# EAGLE schematic tarjeta-v8 (EAGLE 6.4)
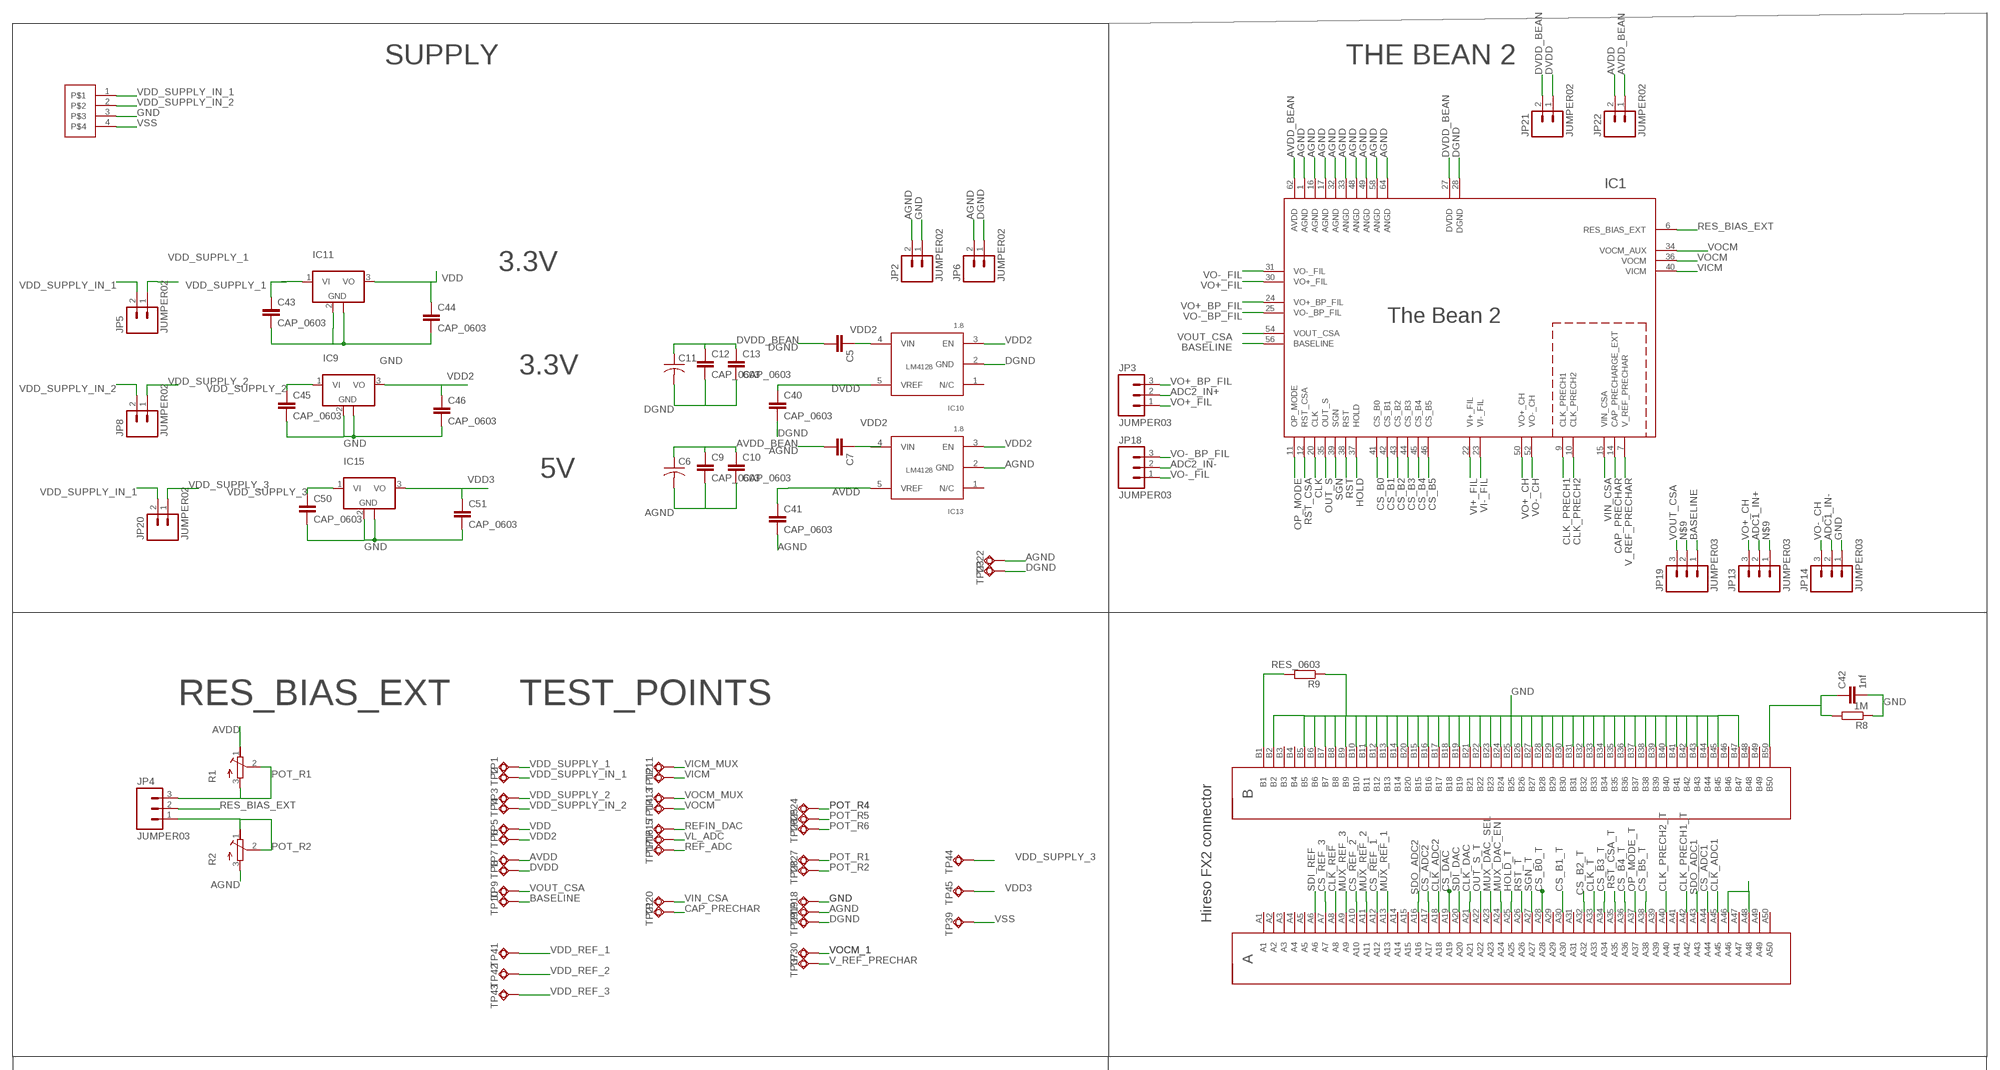
[diagram p0: schematic, sheet 1, part 1 of 3]
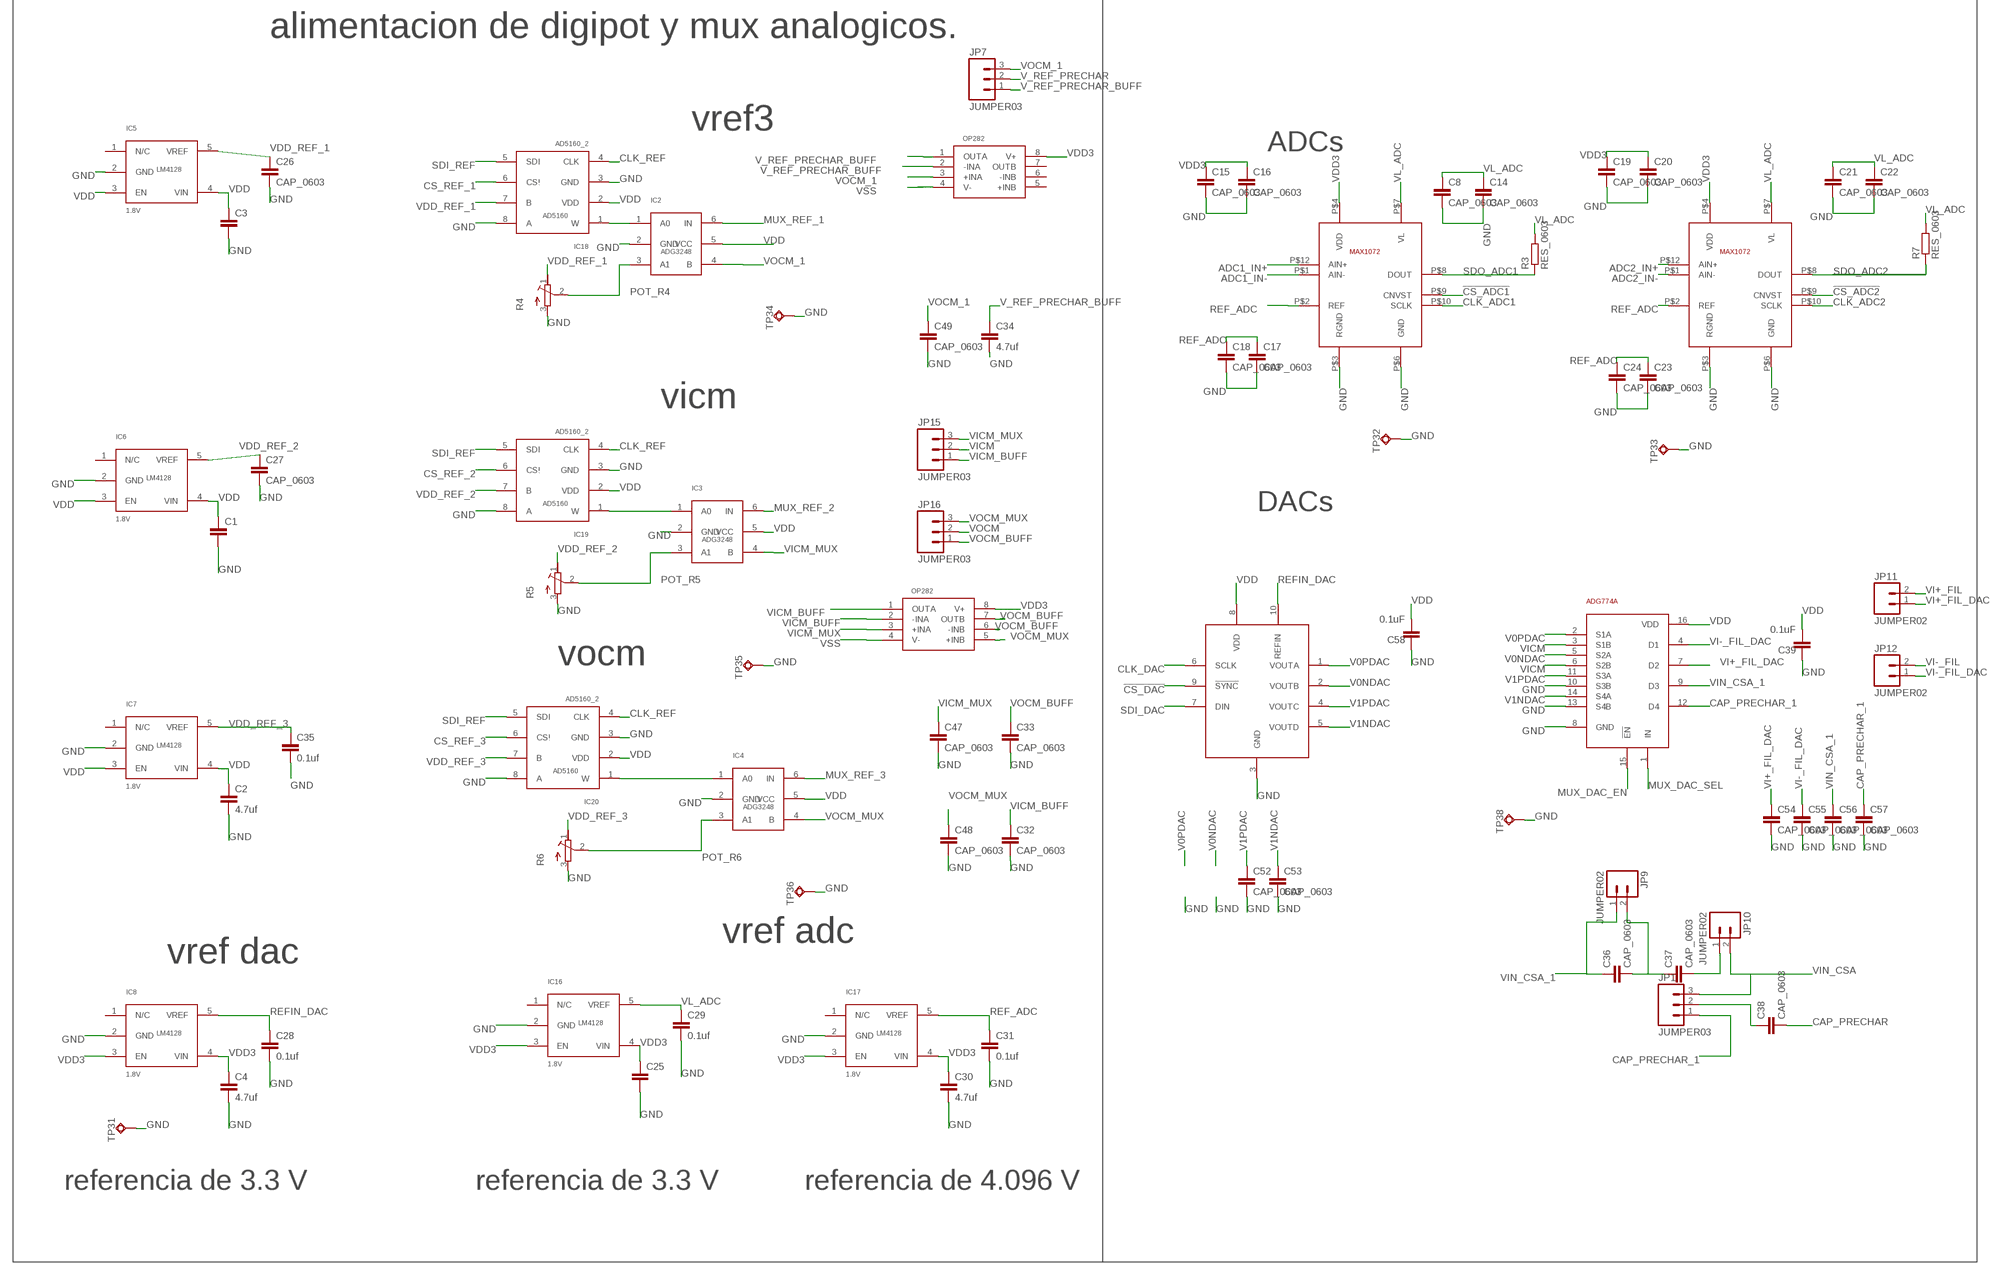
[diagram p1: schematic, sheet 1, part 2 of 3]
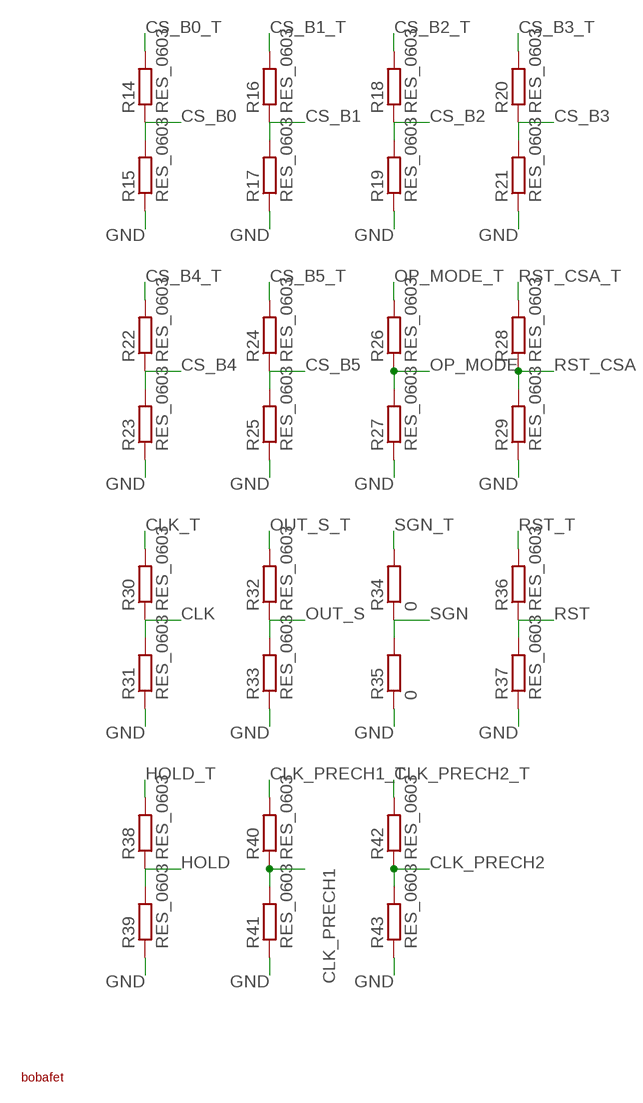
[diagram p2: schematic, sheet 1, part 3 of 3]

## Parts
C1  CAP_0402  [C0402]
C2  4.7uf  CAP_0402  [C0402]
C3  CAP_0402  [C0402]
C4  4.7uf  CAP_0402  [C0402]
C5  CAP_0402  [C0402]
C6  CAP_0805  [C0805]
C7  CAP_0402  [C0402]
C8  CAP_0603  [C0603]
C9  CAP_0603  [C0603]
C10  CAP_0603  [C0603]
C11  CAP_0805  [C0805]
C12  CAP_0603  [C0603]
C13  CAP_0603  [C0603]
C14  CAP_0603  [C0603]
C15  CAP_0603  [C0603]
C16  CAP_0603  [C0603]
C17  CAP_0603  [C0603]
C18  CAP_0603  [C0603]
C19  CAP_0603  [C0603]
C20  CAP_0603  [C0603]
C21  CAP_0603  [C0603]
C22  CAP_0603  [C0603]
C23  CAP_0603  [C0603]
C24  CAP_0603  [C0603]
C25  CAP_0402  [C0402]
C26  CAP_0603  [C0603]
C27  CAP_0603  [C0603]
C28  0.1uf  CAP_0603  [C0603]
C29  0.1uf  CAP_0603  [C0603]
C30  4.7uf  CAP_0402  [C0402]
C31  0.1uf  CAP_0603  [C0603]
C32  CAP_0603  [C0603]
C33  CAP_0603  [C0603]
C34  4.7uf  CAP_0603  [C0603]
C35  0.1uf  CAP_0603  [C0603]
C36  CAP_0603  [C0603]
C37  CAP_0603  [C0603]
C38  CAP_0603  [C0603]
C39  0.1uF  CAP_0603  [C0603]
C40  CAP_0603  [C0603]
C41  CAP_0603  [C0603]
C42  1nf  CAP_0603  [C0603]
C43  CAP_0603  [C0603]
C44  CAP_0603  [C0603]
C45  CAP_0603  [C0603]
C46  CAP_0603  [C0603]
C47  CAP_0603  [C0603]
C48  CAP_0603  [C0603]
C49  CAP_0603  [C0603]
C50  CAP_0603  [C0603]
C51  CAP_0603  [C0603]
C52  CAP_0603  [C0603]
C53  CAP_0603  [C0603]
C54  CAP_0603  [C0603]
C55  CAP_0603  [C0603]
C56  CAP_0603  [C0603]
C57  CAP_0603  [C0603]
C58  0.1uF  CAP_0603  [C0603]
IC1  THE_BEAN_2  [QFN64]
IC2  ADG3248  [SC70]
IC3  ADG3248  [SC70]
IC4  ADG3248  [SC70]
IC5  1.8V  LM4128_2  [SOT23-5L_2]
IC6  1.8V  LM4128_2  [SOT23-5L_2]
IC7  1.8V  LM4128_2  [SOT23-5L_2]
IC8  1.8V  LM4128_2  [SOT23-5L_2]
IC9  UA78M  [SOT223]
IC10  1.8  LM4128_2  [SOT23-5L_2]
IC11  UA78M  [SOT223]
IC12  OP282  [SOIC8]
IC13  1.8  LM4128_2  [SOT23-5L_2]
IC14  OP282  [SOIC8]
IC15  UA78M  [SOT223]
IC16  1.8V  LM4128_2  [SOT23-5L_2]
IC17  1.8V  LM4128_2  [SOT23-5L_2]
IC18  AD5160_2  [SOT23-8_2]
IC19  AD5160_2  [SOT23-8_2]
IC20  AD5160_2  [SOT23-8_2]
IC21  ADG774A  [QSOP16]
IC22  MAX1072  [TQFN12]
IC23  DAC7554  [MSOP10]
IC24  MAX1072  [TQFN12]
J1  HIRESO_FX_CONNECTOR  [FX2-100S-1.27]
JP1  JUMPER03  [1X03]
JP2  JUMPER02  [1X02]
JP3  JUMPER03  [1X03]
JP4  JUMPER03  [1X03]
JP5  JUMPER02  [1X02]
JP6  JUMPER02  [1X02]
JP7  JUMPER03  [1X03]
JP8  JUMPER02  [1X02]
JP9  JUMPER02  [1X02]
JP10  JUMPER02  [1X02]
JP11  JUMPER02  [1X02]
JP12  JUMPER02  [1X02]
JP13  JUMPER03  [1X03]
JP14  JUMPER03  [1X03]
JP15  JUMPER03  [1X03]
JP16  JUMPER03  [1X03]
JP17  JUMPER04  [1X04]
JP18  JUMPER03  [1X03]
JP19  JUMPER03  [1X03]
JP20  JUMPER02  [1X02]
JP21  JUMPER02  [1X02]
JP22  JUMPER02  [1X02]
R1  TRIMMER_ST5  [ST-5EW]
R2  TRIMMER_ST5  [ST-5EW]
R3  RES_0603  [R0603]
R4  TRIMMER_ST5  [ST-5EW]
R5  TRIMMER_ST5  [ST-5EW]
R6  TRIMMER_ST5  [ST-5EW]
R7  RES_0603  [R0603]
R8  1M  RES_0603  [R0603]
R9  RES_0603  [R0603]
R14  RES_0603  [R0603]
R15  RES_0603  [R0603]
R16  RES_0603  [R0603]
R17  RES_0603  [R0603]
R18  RES_0603  [R0603]
R19  RES_0603  [R0603]
R20  RES_0603  [R0603]
R21  RES_0603  [R0603]
R22  RES_0603  [R0603]
R23  RES_0603  [R0603]
R24  RES_0603  [R0603]
R25  RES_0603  [R0603]
R26  RES_0603  [R0603]
R27  RES_0603  [R0603]
R28  RES_0603  [R0603]
R29  RES_0603  [R0603]
R30  RES_0603  [R0603]
R31  RES_0603  [R0603]
R32  RES_0603  [R0603]
R33  RES_0603  [R0603]
R34  0  RES_0603  [R0603]
R35  0  RES_0603  [R0603]
R36  RES_0603  [R0603]
R37  RES_0603  [R0603]
R38  RES_0603  [R0603]
R39  RES_0603  [R0603]
R40  RES_0603  [R0603]
R41  RES_0603  [R0603]
R42  RES_0603  [R0603]
R43  RES_0603  [R0603]
TP1  TEST_POINT  [TP]
TP2  TEST_POINT  [TP]
TP3  TEST_POINT  [TP]
TP4  TEST_POINT  [TP]
TP5  TEST_POINT  [TP]
TP6  TEST_POINT  [TP]
TP7  TEST_POINT  [TP]
TP8  TEST_POINT  [TP]
TP9  TEST_POINT  [TP]
TP10  TEST_POINT  [TP]
TP11  TEST_POINT  [TP]
TP12  TEST_POINT  [TP]
TP13  TEST_POINT  [TP]
TP14  TEST_POINT  [TP]
TP15  TEST_POINT  [TP]
TP16  TEST_POINT  [TP]
TP17  TEST_POINT  [TP]
TP18  TEST_POINT  [TP]
TP19  TEST_POINT  [TP]
TP20  TEST_POINT  [TP]
TP21  TEST_POINT  [TP]
TP22  TEST_POINT  [TP]
TP23  TEST_POINT  [TP]
TP24  TEST_POINT  [TP]
TP25  TEST_POINT  [TP]
TP26  TEST_POINT  [TP]
TP27  TEST_POINT  [TP]
TP28  TEST_POINT  [TP]
TP29  TEST_POINT  [TP]
TP30  TEST_POINT  [TP]
TP31  TEST_POINT  [TP]
TP32  TEST_POINT  [TP]
TP33  TEST_POINT  [TP]
TP34  TEST_POINT  [TP]
TP35  TEST_POINT  [TP]
TP36  TEST_POINT  [TP]
TP37  TEST_POINT  [TP]
TP38  TEST_POINT  [TP]
TP39  TEST_POINT  [TP]
TP41  TEST_POINT  [TP]
TP42  TEST_POINT  [TP]
TP43  TEST_POINT  [TP]
TP44  TEST_POINT  [TP]
TP45  TEST_POINT  [TP]
U$1  LOGO  [LOGO]

## Nets
!CS_ADC1: IC22.P$9(CNVST) J1.A44
!CS_ADC2: IC24.P$9(CNVST) J1.A17
!CS_DAC: IC23.9(!SYNC) J1.A19
ADC1_IN+: IC22.P$12(AIN+) JP13.2
ADC1_IN-: IC22.P$1(AIN-) JP14.2
ADC2_IN+: IC24.P$12(AIN+) JP3.2
ADC2_IN-: IC24.P$1(AIN-) JP18.2
AGND: C6.2 C7.2 C9.2 C10.2 C41.2 IC1.1(AGND) IC1.16(AGND) IC1.17(AGND) IC1.32(AGND) IC1.33(ANGD) IC1.48(ANGD) IC1.49(ANGD) IC1.58(ANGD) IC1.64(ANGD) IC13.2(GND) JP2.2 JP6.2 R2.3 TP19.TP TP22.TP
AVDD: C41.1 IC13.5(VREF) JP22.2 R1.1 TP7.TP
AVDD_BEAN: C6.1 C9.1 C10.1 IC1.62(AVDD) JP22.1
BASELINE: IC1.56(BASELINE) JP19.1 TP10.TP
CAP_PRECHAR: C38.2 IC1.14(CAP_PRECHARGE_EXT) TP21.TP
CAP_PRECHAR_1: C57.1 IC21.12(D4) JP1.1
CLK: IC1.20(CLK) R30.1 R31.2
CLK_ADC1: IC22.P$10(SCLK) J1.A45
CLK_ADC2: IC24.P$10(SCLK) J1.A18
CLK_DAC: IC23.6(SCLK) J1.A21
CLK_PRECH1: IC1.9(CLK_PRECH1) R40.1 R41.2
CLK_PRECH1_T: J1.A42 R40.2
CLK_PRECH2: IC1.10(CLK_PRECH2) R42.1 R43.2
CLK_PRECH2_T: J1.A40 R42.2
CLK_REF: IC18.4(CLK) IC19.4(CLK) IC20.4(CLK) J1.A8
CLK_T: J1.A33 R30.2
CS_B0: IC1.41(CS_B0) R14.1 R15.2
CS_B0_T: J1.A28 R14.2
CS_B1: IC1.42(CS_B1) R16.1 R17.2
CS_B1_T: J1.A30 R16.2
CS_B2: IC1.43(CS_B2) R18.1 R19.2
CS_B2_T: J1.A32 R18.2
CS_B3: IC1.44(CS_B3) R20.1 R21.2
CS_B3_T: J1.A34 R20.2
CS_B4: IC1.45(CS_B4) R22.1 R23.2
CS_B4_T: J1.A36 R22.2
CS_B5: IC1.46(CS_B5) R24.1 R25.2
CS_B5_T: J1.A38 R24.2
CS_REF_1: IC18.6(CS!) J1.A12
CS_REF_2: IC19.6(CS!) J1.A10
CS_REF_3: IC20.6(CS!) J1.A7
DGND: C5.2 C11.2 C12.2 C13.2 C40.2 IC1.28(DGND) IC10.2(GND) JP6.1 TP23.TP TP29.TP
DVDD: C40.1 IC10.5(VREF) JP21.1 TP8.TP
DVDD_BEAN: C11.1 C12.1 C13.1 IC1.27(DVDD) JP21.2
GND: C1.2 C2.2 C3.2 C4.2 C8.2 C14.2 C15.2 C16.2 C17.2 C18.2 C19.2 C20.2 C21.2 C22.2 C23.2 C24.2 C25.2 C26.2 C27.2 C28.2 C29.2 C30.2 C31.2 C32.2 C33.2 C34.2 C35.2 C39.1 C42.2 C43.2 C44.2 C45.2 C46.2 C47.2 C48.2 C49.2 C50.2 C51.2 C52.2 C53.2 C54.2 C55.2 C56.2 C57.2 C58.1 IC2.2(GND) IC3.2(GND) IC4.2(GND) IC5.2(GND) IC6.2(GND) IC7.2(GND) IC8.2(GND) IC9.2(GND) IC9.4(GND) IC11.2(GND) IC11.4(GND) IC15.2(GND) IC15.4(GND) IC16.2(GND) IC17.2(GND) IC18.3(GND) IC18.8(A) IC19.3(GND) IC19.8(A) IC20.3(GND) IC20.8(A) IC21.8(GND) IC21.10(S3B) IC21.13(S4B) IC22.P$3(RGND) IC22.P$6(GND) IC23.3(GND) IC24.P$3(RGND) IC24.P$6(GND) J1.B2 J1.B5 J1.B6 J1.B7 J1.B8 J1.B9 J1.B10 J1.B11 J1.B12 J1.B13 J1.B14 J1.B15 J1.B16 J1.B17 J1.B18 J1.B19 J1.B20 J1.B21 J1.B22 J1.B23 J1.B24 J1.B25 J1.B26 J1.B27 J1.B28 J1.B29 J1.B30 J1.B31 J1.B32 J1.B33 J1.B34 J1.B35 J1.B36 J1.B37 J1.B38 J1.B39 J1.B40 J1.B41 J1.B42 J1.B43 J1.B44 J1.B45 J1.B47 JP2.1 JP14.1 JP17.3 R4.3 R5.3 R6.3 R8.1 R9.1 R15.1 R17.1 R19.1 R21.1 R23.1 R25.1 R27.1 R29.1 R31.1 R33.1 R35.1 R37.1 R39.1 R41.1 R43.1 TP18.TP TP31.TP TP32.TP TP33.TP TP34.TP TP35.TP TP36.TP TP38.TP
HOLD: IC1.37(HOLD) R38.1 R39.2
HOLD_T: J1.A25 R38.2
MUX_DAC_EN: IC21.15(!EN) J1.A24
MUX_DAC_SEL: IC21.1(IN) J1.A23
MUX_REF_1: IC2.6(IN) J1.A13
MUX_REF_2: IC3.6(IN) J1.A11
MUX_REF_3: IC4.6(IN) J1.A9
N$1: C36.2 C37.1 JP9.2
N$2: J1.B1 R9.2
N$3: C37.2 JP10.1
N$4: J1.A46 J1.A48
N$5: IC4.1(A0) IC20.1(W)
N$6: C38.1 JP1.2
N$9: JP13.1 JP19.2
N$10: C42.1 J1.B50 R8.2
N$17: IC2.1(A0) IC18.1(W)
N$19: IC3.1(A0) IC19.1(W)
OP_MODE: IC1.11(OP_MODE) R26.1 R27.2
OP_MODE_T: J1.A37 R26.2
OUT_S: IC1.35(OUT_S) R32.1 R33.2
OUT_S_T: J1.A22 R32.2
POT_R1: JP4.3 R1.2 R1.3 TP27.TP
POT_R2: JP4.1 R2.1 R2.2 TP28.TP
POT_R4: IC2.3(A1) R4.2 TP24.TP
POT_R5: IC3.3(A1) R5.2 TP25.TP
POT_R6: IC4.3(A1) R6.2 TP26.TP
REF_ADC: C17.1 C18.1 C23.1 C24.1 C31.1 IC17.5(VREF) IC22.P$2(REF) IC24.P$2(REF) TP17.TP
REFIN_DAC: C28.1 IC8.5(VREF) IC23.10(REFIN) TP15.TP
RES_BIAS_EXT: IC1.6(RES_BIAS_EXT) JP4.2
RST: IC1.38(RST) R36.1 R37.2
RST_CSA: IC1.12(RST_CSA) R28.1 R29.2
RST_CSA_T: J1.A35 R28.2
RST_T: J1.A26 R36.2
SDI_DAC: IC23.7(DIN) J1.A20
SDI_REF: IC18.5(SDI) IC19.5(SDI) IC20.5(SDI) J1.A6
SDO_ADC1: IC22.P$8(DOUT) J1.A43 R3.1
SDO_ADC2: IC24.P$8(DOUT) J1.A16 R7.1
SGN: IC1.39(SGN) R34.1 R35.2
SGN_T: J1.A27 R34.2
V0NDAC: IC21.5(S2A) IC23.2(VOUTB)
V0PDAC: IC21.2(S1A) IC23.1(VOUTA)
V1NDAC: C53.1 IC21.14(S4A) IC23.5(VOUTD)
V1PDAC: C52.1 IC21.11(S3A) IC23.4(VOUTC)
V_REF_PRECHAR: IC1.7(V_REF_PRECHAR) JP7.2 TP37.TP
V_REF_PRECHAR_BUFF: C34.1 IC14.1(OUTA) IC14.2(-INA) JP7.1
VDD: C1.1 C2.1 C3.1 C39.2 C44.1 C58.2 IC2.5(VCC) IC3.5(VCC) IC4.5(VCC) IC5.3(EN) IC5.4(VIN) IC6.3(EN) IC6.4(VIN) IC7.3(EN) IC7.4(VIN) IC11.3(VO) IC18.2(VDD) IC19.2(VDD) IC20.2(VDD) IC21.16(VDD) IC23.8(VDD) TP5.TP
VDD2: C5.1 C7.1 C46.1 IC9.3(VO) IC10.3(EN) IC10.4(VIN) IC13.3(EN) IC13.4(VIN) TP6.TP
VDD3: C4.1 C15.1 C16.1 C19.1 C20.1 C25.1 C30.1 C51.1 IC8.3(EN) IC8.4(VIN) IC12.8(V+) IC14.8(V+) IC15.3(VO) IC16.3(EN) IC16.4(VIN) IC17.3(EN) IC17.4(VIN) IC22.P$4(VDD) IC24.P$4(VDD) TP45.TP
VDD_REF_1: C26.1 IC5.5(VREF) IC18.7(B) R4.1 TP41.TP
VDD_REF_2: C27.1 IC6.5(VREF) IC19.7(B) R5.1 TP42.TP
VDD_REF_3: C35.1 IC7.5(VREF) IC20.7(B) R6.1 TP43.TP
VDD_SUPPLY_1: C43.1 IC11.1(VI) JP5.1 TP1.TP
VDD_SUPPLY_2: C45.1 IC9.1(VI) JP8.1 TP3.TP
VDD_SUPPLY_3: C50.1 IC15.1(VI) JP20.1 TP44.TP
VDD_SUPPLY_IN_1: JP5.2 JP17.1 JP20.2 TP2.TP
VDD_SUPPLY_IN_2: JP8.2 JP17.2 TP4.TP
VI+_FIL: IC1.22(VI+_FIL) JP11.2
VI+_FIL_DAC: C54.1 IC21.4(D1) JP11.1
VI-_FIL: IC1.23(VI-_FIL) JP12.2
VI-_FIL_DAC: C55.1 IC21.7(D2) JP12.1
VICM: IC1.40(VICM) IC21.3(S1B) IC21.6(S2B) JP15.2 TP12.TP
VICM_BUFF: C32.1 IC12.1(OUTA) IC12.2(-INA) JP15.1
VICM_MUX: C47.1 IC3.4(B) IC12.3(+INA) JP15.3 TP11.TP
VIN_CSA: IC1.15(VIN_CSA) JP1.3 JP10.2 TP20.TP
VIN_CSA_1: C36.1 C56.1 IC21.9(D3) JP9.1
VL_ADC: C8.1 C14.1 C21.1 C22.1 C29.1 IC16.5(VREF) IC22.P$7(VL) IC24.P$7(VL) R3.2 R7.2 TP16.TP
VO+_BP_FIL: IC1.24(VO+_BP_FIL) JP3.3
VO+_CH: IC1.50(VO+_CH) JP13.3
VO+_FIL: IC1.30(VO+_FIL) JP3.1
VO-_BP_FIL: IC1.25(VO-_BP_FIL) JP18.3
VO-_CH: IC1.52(VO-_CH) JP14.3
VO-_FIL: IC1.31(VO-_FIL) JP18.1
VOCM: IC1.34(VOCM_AUX) IC1.36(VOCM) JP16.2 TP14.TP
VOCM_1: C49.1 IC2.4(B) IC14.3(+INA) JP7.3 TP30.TP
VOCM_BUFF: C33.1 IC12.6(-INB) IC12.7(OUTB) JP16.1
VOCM_MUX: C48.1 IC4.4(B) IC12.5(+INB) JP16.3 TP13.TP
VOUT_CSA: IC1.54(VOUT_CSA) JP19.3 TP9.TP
VSS: IC12.4(V-) IC14.4(V-) JP17.4 TP39.TP
Unconnected: IC5.1(N/C) IC6.1(N/C) IC7.1(N/C) IC8.1(N/C) IC10.1(N/C) IC13.1(N/C) IC14.5(+INB) IC14.6(-INB) IC14.7(OUTB) IC16.1(N/C) IC17.1(N/C) J1.A1 J1.A2 J1.A3 J1.A4 J1.A5 J1.A14 J1.A15 J1.A29 J1.A31 J1.A39 J1.A41 J1.A47 J1.A49 J1.A50 J1.B3 J1.B4 J1.B46 J1.B48 J1.B49

## Notes on the sheet
- SUPPLY | THE BEAN 2
- 3.3V
- 3.3V
- 5V
- RES_BIAS_EXT | TEST_POINTS
- alimentacion de digipot y mux analogicos.
- vref3
- ADCs
- vicm
- DACs
- vocm
- vref adc
- vref dac
- referencia de 3.3 V | referencia de 3.3 V | referencia de 4.096 V

## Library data of the parts
C1-C5 C7 C25 C30 = wac:CAP_0402
C6 C11 = wac:CAP_0805
C8-C10 C12-C24 C26-C29 C31-C58 = wac:CAP_0603
IC1 = wac:THE_BEAN_2
IC2-IC4 = wac:ADG3248
IC5-IC8 IC10 IC13 IC16 IC17 = wac:LM4128_2
IC9 IC11 IC15 = wac:UA78M
IC12 IC14 = wac:OP282: OP282. Package:8-lead MSOP. Obtenido desde http://www.analog.com/media/en/technical-documentation/data-sheets/OP282_482.pdf
IC18-IC20 = wac:AD5160_2
IC21 = wac:ADG774A: Low voltage,400MHz, Quad 2:1 MUX with 3ns Switching Time http://www.analog.com/static/imported-files/data_sheets/ADG774A.pdf
IC22 IC24 = wac:MAX1072
IC23 = wac:DAC7554: 12-BIT, QUAD, ULTRALOW GLITCH, VOLTAGE OUTPUT DIGITAL-TO-ANALOG CONVERTER http://www.ti.com/lit/ds/symlink/dac7554.pdf
J1 = wac:HIRESO_FX_CONNECTOR: Conector Hireso de la serie FX2. Part Number: FX2-100S-1.27DS(L)
JP1 JP3 JP4 JP7 JP13-JP16 JP18 JP19 = wac:JUMPER03
JP2 JP5 JP6 JP8-JP12 JP20-JP22 = wac:JUMPER02
JP17 = wac:JUMPER04
R1 R2 R4-R6 = wac:TRIMMER_ST5
R3 R7-R9 R14-R43 = wac:RES_0603
TP1-TP39 TP41-TP45 = wac:TEST_POINT
U$1 = wac:LOGO